# EAGLE design can_shield_simplified (EAGLE 7.7.0)
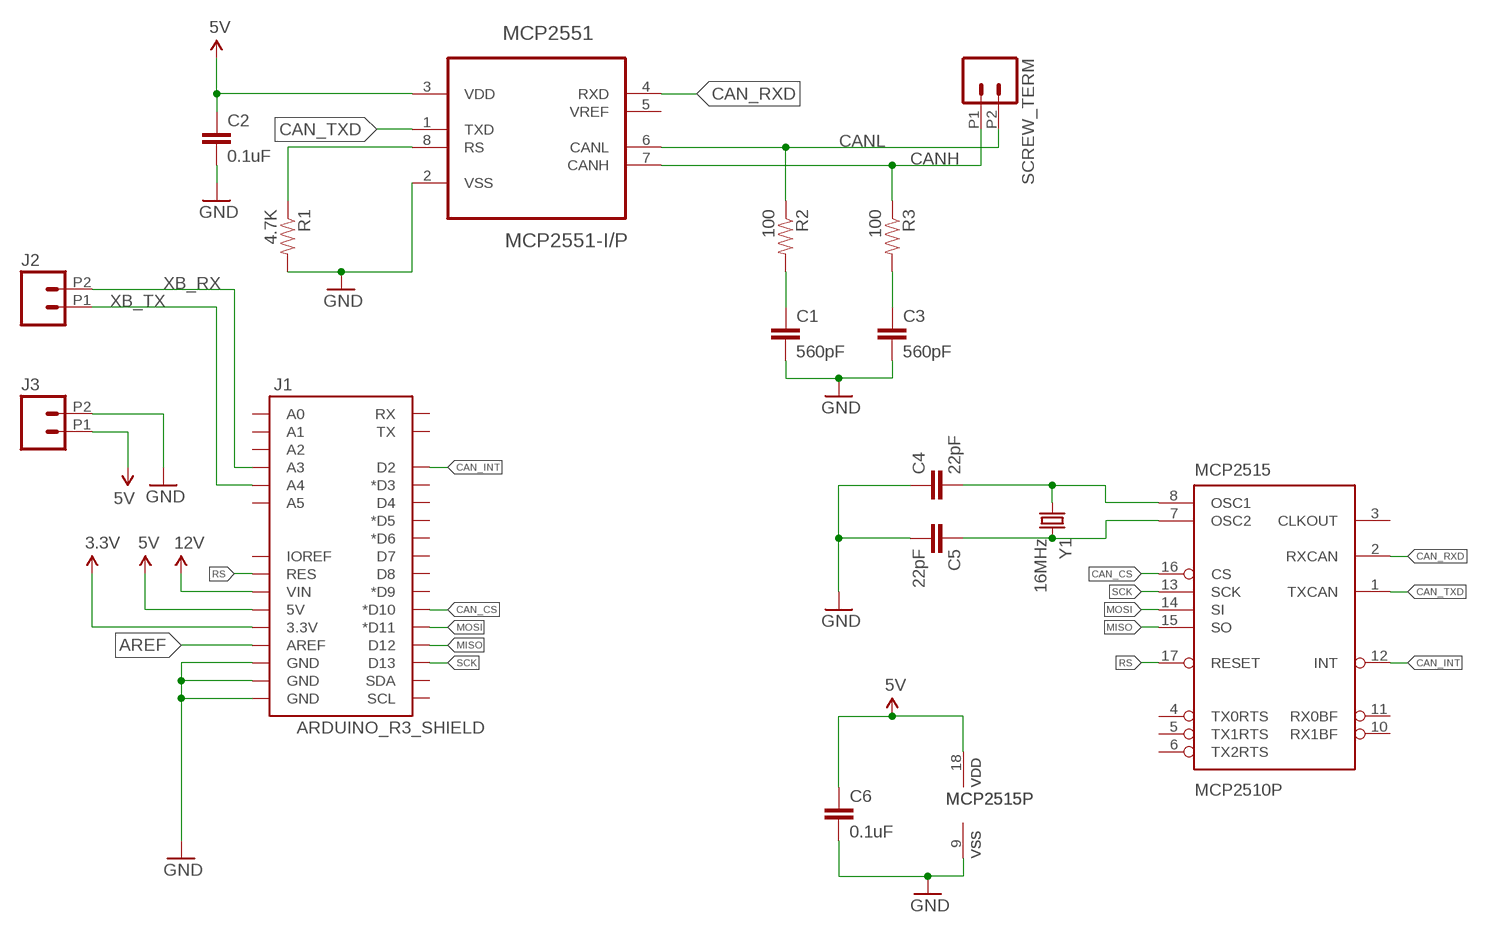
[diagram p0: schematic, sheet 1]

## Parts
C1  560pF  CAPPTH  [CAP-PTH-SMALL]
C2  0.1uF  CAPPTH  [CAP-PTH-SMALL]
C3  560pF  CAPPTH  [CAP-PTH-SMALL]
C4  22pF  CAPPTH  [CAP-PTH-SMALL]
C5  22pF  CAPPTH  [CAP-PTH-SMALL]
C6  0.1uF  CAPPTH  [CAP-PTH-SMALL]
J1  ARDUINO_R3_SHIELD  [UNO_R3_SHIELD]
J2  M022.54MM_SCREWTERM  [1X02_2.54_SCREWTERM]
J3  M022.54MM_SCREWTERM  [1X02_2.54_SCREWTERM]
MCP2515  MCP2510P  [DIL18]
MCP2551  MCP2551-I/P  [DIP254P762X432-8]
R1  4.7K  RESISTORAXIAL-0.3  [AXIAL-0.3]
R2  100  RESISTORAXIAL-0.3  [AXIAL-0.3]
R3  100  RESISTORAXIAL-0.3  [AXIAL-0.3]
SCREW_TERM  M022.54MM_SCREWTERM  [1X02_2.54_SCREWTERM]
Y1  16MHz  CRYSTALHC49US  [HC49US]

## Nets
3.3V: J1.3.3V
5V: C2.1 C6.1 J1.5V J3.P1 MCP2515.18(VDD) MCP2551.3(VDD)
12V: J1.VIN
AREF: J1.AREF
CAN_CS: J1.D10(*D10) MCP2515.16(CS)
CAN_INT: J1.D2 MCP2515.12(INT)
CAN_RXD: MCP2515.2(RXCAN) MCP2551.4(RXD)
CAN_TXD: MCP2515.1(TXCAN) MCP2551.1(TXD)
CANH: MCP2551.7(CANH) R3.P$1 SCREW_TERM.P1
CANH_CAP: C3.1 R3.P$2
CANL: MCP2551.6(CANL) R2.P$1 SCREW_TERM.P2
CANL_CAP: C1.1 R2.P$2
GND: C1.2 C2.2 C3.2 C4.1 C5.2 C6.2 J1.GND@0(GND) J1.GND@1(GND) J1.GND@2(GND) J3.P2 MCP2515.9(VSS) MCP2551.2(VSS) R1.P$2
MISO: J1.D12 MCP2515.15(SO)
MOSI: J1.D11(*D11) MCP2515.14(SI)
N$1: MCP2551.8(RS) R1.P$1
N$2: C4.2 MCP2515.8(OSC1) Y1.1
N$3: C5.1 MCP2515.7(OSC2) Y1.2
RS: J1.RES MCP2515.17(RESET)
SCK: J1.D13 MCP2515.13(SCK)
XB_RX: J1.A3 J2.P2
XB_TX: J1.A4 J2.P1
Unconnected: J1.A0 J1.A1 J1.A2 J1.A5 J1.D3(*D3) J1.D4 J1.D5(*D5) J1.D6(*D6) J1.D7 J1.D8 J1.D9(*D9) J1.IOREF J1.RX J1.SCL J1.SDA J1.TX MCP2515.3(CLKOUT) MCP2515.4(TX0RTS) MCP2515.5(TX1RTS) MCP2515.6(TX2RTS) MCP2515.10(RX1BF) MCP2515.11(RX0BF) MCP2551.5(VREF)

## Library data of the parts
C1-C6 = SparkFun-Passives:CAP: Capacitor Standard 0603 ceramic capacitor, and 0.1" leaded capacitor.
J1 = SparkFun-Boards:ARDUINO_R3_SHIELD: Shield form compatible with the Arduino Uno R3.
J2 J3 SCREW_TERM = SparkFun-Connectors:M02: Standard 2-pin 0.1" header. Use with - straight break away headers ( PRT-00116) - right angle break away headers (PRT-00553) - swiss pins (PRT-00743) - machine pins (PRT-00117) - female headers (PRT-00115) Molex polarized connector foot print use with: PRT-08233 with associated crimp pins and housings. 2.54_SCREWTERM for use with PRT-10571. 3.5mm Screw Terminal footprints for PRT-08084 5mm Screw Terminal footprints for use with PRT-08432
MCP2515 = SparkFun-DigitalIC:MCP2510: CAN controller with SPI interface to any MCU. Original design by Microchip.
MCP2551 = can_transceiver:MCP2551-I/P: High-Speed CAN Transceiver; DESCRIPTION: CAN CTRL; MPN: MCP2551-I/P; OC_FARNELL: 1292240; OC_NEWARK: 61K2947; PACKAGE: PDIP-8; SUPPLIER: Microchip
R1-R3 = SparkFun-Passives:RESISTOR: Resistor Basic schematic elements and footprints for 0603, 1206, and PTH resistors.
Y1 = SparkFun-FreqCtrl:CRYSTAL: Various standard crystals. Proven footprints.

## Board
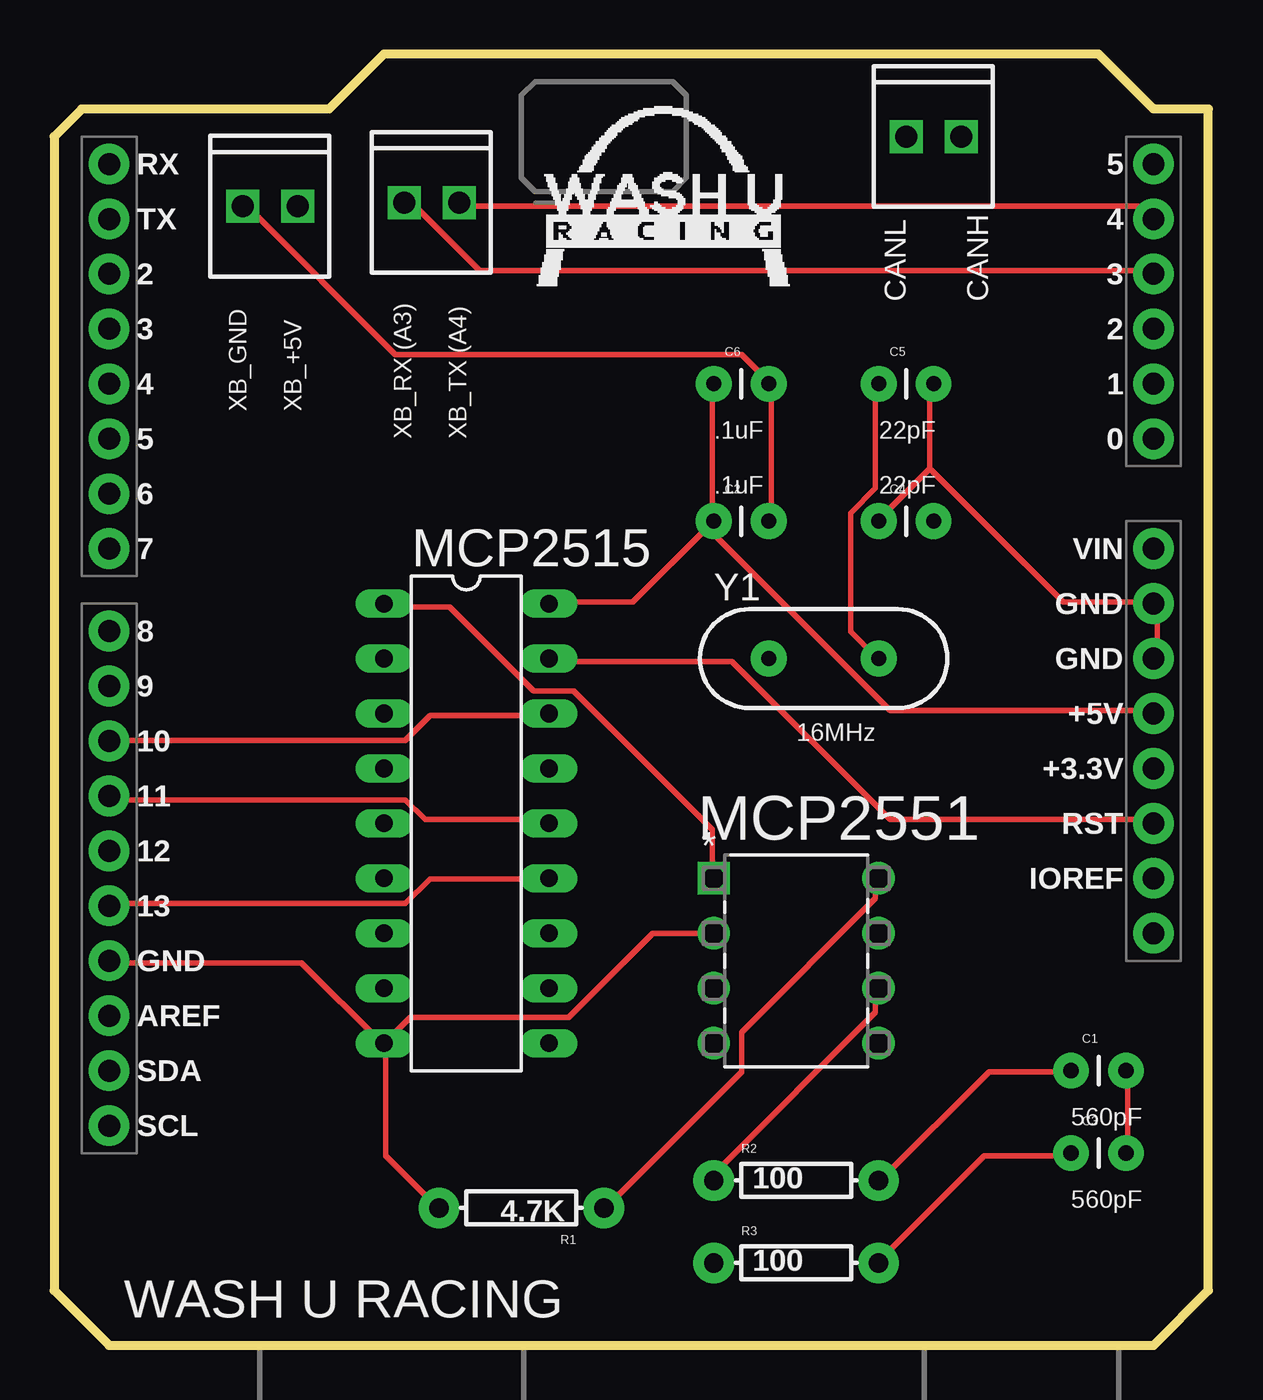
[diagram p1: board, top side]
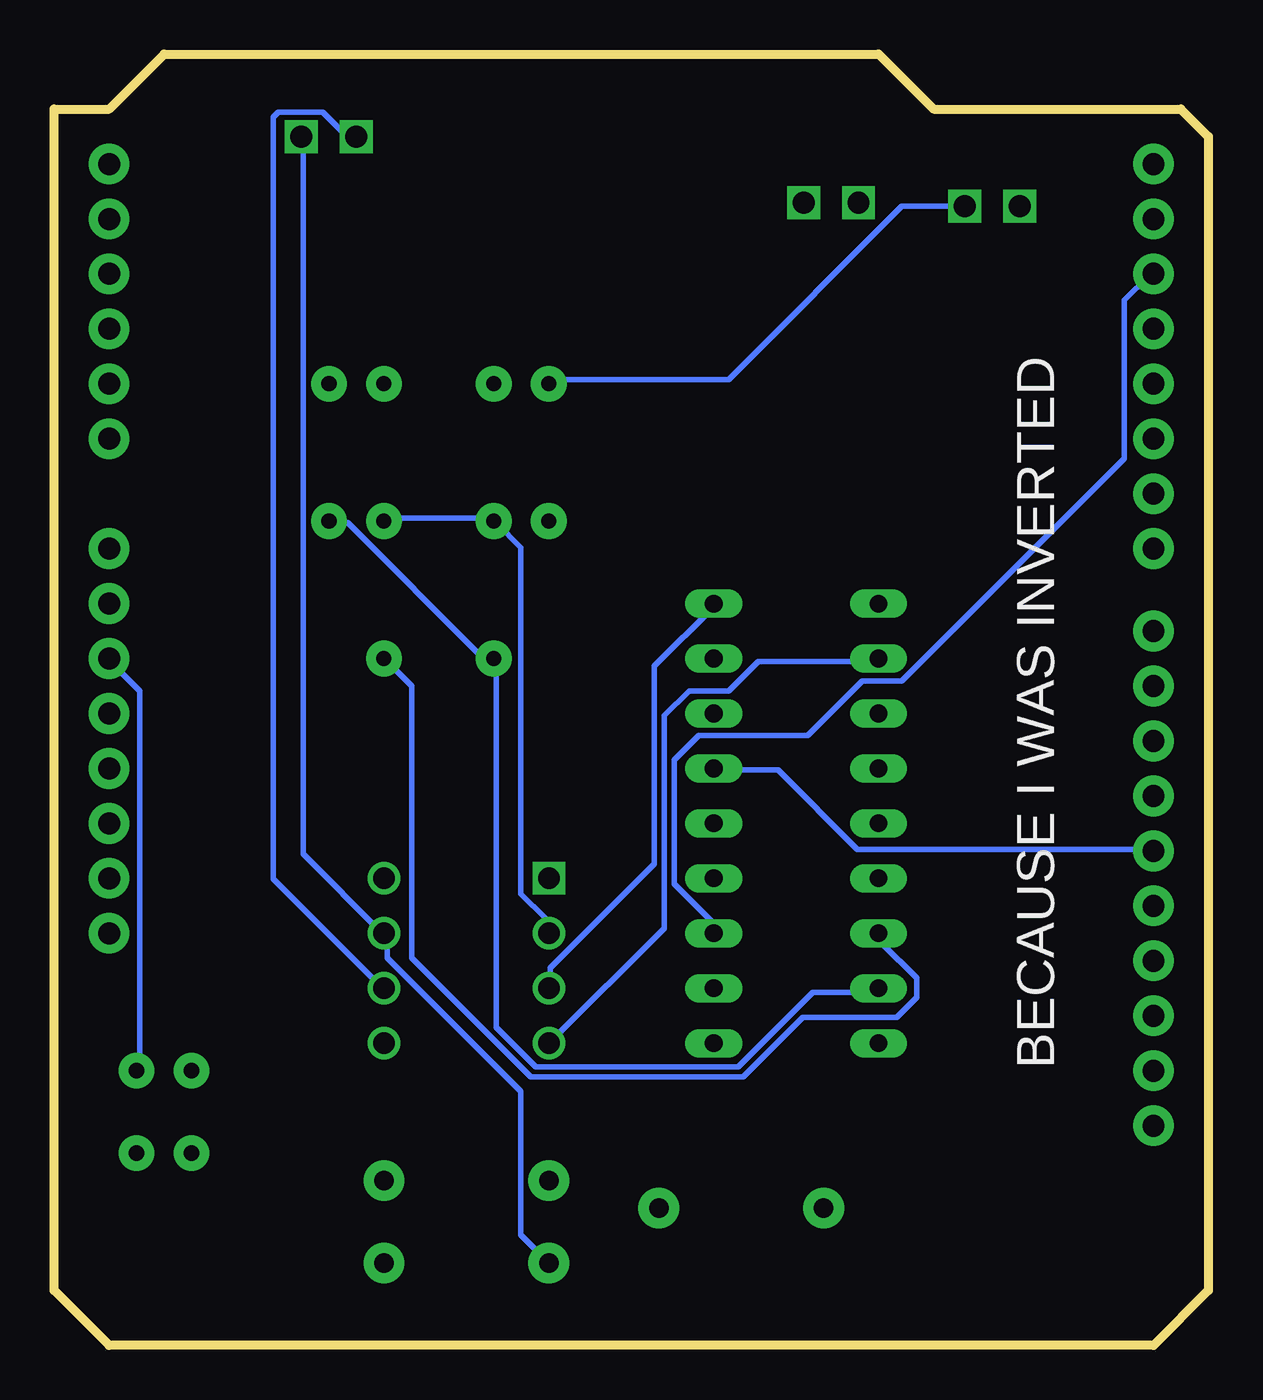
[diagram p2: board, bottom side, seen from below]

Size 53.34 x 59.69 mm. Coordinates in mm from the lower left corner, seen from the top.
Outline: 1.27,57.15 0,55.88 0,2.54 2.54,0 50.8,0 53.34,2.54 53.34,57.15 50.8,57.15 48.26,59.69 15.24,59.69 12.7,57.15 1.27,57.15
Copper layers (1*16): Top 0.035mm / dielectric 1.5mm / Bottom 0.035mm
Design rules "default": minimum track width 10mil, minimum drill 24mil, track to track 8mil, track to pad 8mil, pad to pad 8mil, via to via 8mil, smd to smd 8mil, copper to edge 40mil, drill to drill 8mil, minimum pad ring 10mil, minimum via ring 8mil, stop-mask expansion 4mil, vias tented up to drill 0mil, thermal gap 10mil

### Footprints (pad centres in the part's own frame; a part is rotated, then mirrored left to right if it is on the bottom)
CAP-PTH-SMALL = drill 0.7 pad 1.651: 1 0,0; 2 2.54,0
UNO_R3_SHIELD = drill 1.016 pad 1.88: 3.3V 50.8,26.67; 5V 50.8,29.21; A0 50.8,41.91; A1 50.8,44.45; A2 50.8,46.99; A3 50.8,49.53; A4 50.8,52.07; A5 50.8,54.61; AREF 2.54,15.24; D2 2.54,49.53; D3 2.54,46.99; D4 2.54,44.45; D5 2.54,41.91; D6 2.54,39.37; D7 2.54,36.83; D8 2.54,33.02; D9 2.54,30.48; D10 2.54,27.94; D11 2.54,25.4; D12 2.54,22.86; D13 2.54,20.32; GND@0 50.8,31.75; GND@1 50.8,34.29; GND@2 2.54,17.78; IOREF 50.8,21.59; NC 50.8,19.05; RES 50.8,24.13; RX 2.54,54.61; SCL 2.54,10.16; SDA 2.54,12.7; TX 2.54,52.07; VIN 50.8,36.83
1X02_2.54_SCREWTERM = drill 1.016 square: P1 2.54,0; P2 0,0
DIL18 = drill 0.813 long: 1 -10.16,-3.81; 2 -7.62,-3.81; 3 -5.08,-3.81; 4 -2.54,-3.81; 5 0,-3.81; 6 2.54,-3.81; 7 5.08,-3.81; 8 7.62,-3.81; 9 10.16,-3.81; 10 10.16,3.81; 11 7.62,3.81; 12 5.08,3.81; 13 2.54,3.81; 14 0,3.81; 15 -2.54,3.81; 16 -5.08,3.81; 17 -7.62,3.81; 18 -10.16,3.81
DIP254P762X432-8 = drill 0.991 square: 1 -7.62,7.62 | drill 0.991: 2 -7.62,5.08; 3 -7.62,2.54; 4 -7.62,0; 5 0,0; 6 0,2.54; 7 0,5.08; 8 0,7.62
AXIAL-0.3 = drill 0.9 pad 1.88: P$1 -3.81,0; P$2 3.81,0
HC49US = drill 0.7 pad 1.651: 1 -2.54,0; 2 2.54,0

### Placement (x,y rotation side)
C1  46.99,12.7 0 top
C2  30.48,38.1 0 top
C3  46.99,8.89 0 top
C4  38.1,38.1 0 top
C5  38.1,44.45 0 top
C6  30.48,44.45 0 top
J1  0,0 0 top
J2  16.17,52.83 0 top
J3  8.72,52.66 0 top
MCP2515  19.05,24.13 270 top
MCP2551  38.1,13.97 0 top
R1  21.59,6.35 180 top
R2  34.29,7.62 0 top
R3  34.29,3.81 0 top
SCREW_TERM  39.37,55.88 0 top
Y1  35.56,31.75 0 top

### Tracks (layer width: path | path; a pad name or v marks a point on that pad's centre or on a via)
5V
  Top 0.254: C2.1 30.18,37.79 | 30.18,37.79 26.75,34.37 22.86,34.37 MCP2515.18 | 30.18,37.79 38.63,29.34 50.75,29.34 J1.5V | 30.4,38.02 C2.1 | C6.1 30.4,44.42 30.4,38.25 C2.1
  Bottom 0.254: J3.P1 11.43,52.65 14.17,52.65 22.17,44.65 30.4,44.65 C6.1 | MCP2551.3 30.4,16.53 30.4,17.45 25.6,22.25 25.6,31.39 22.86,34.14 MCP2515.18
CAN_CS
  Top 0.254: MCP2515.16 22.86,29.11 17.37,29.11 16.23,27.96 2.74,27.96 J1.D10
CAN_INT
  Bottom 0.254: MCP2515.12 22.86,19.51 24.69,21.34 24.69,27.05 23.55,28.19 18.52,28.19 16,30.71 14.17,30.71 3.89,41 3.89,48.31 2.74,49.45 J1.D2
CAN_RXD
  Bottom 0.254: MCP2515.2 15.32,31.62 20.8,31.62 22.17,30.25 24,30.25 25.15,29.11 25.15,19.28 30.4,14.02 MCP2551.4
CAN_TXD
  Top 0.254: MCP2515.1 15.32,34.14 18.29,34.14 22.17,30.25 24,30.25 30.4,23.85 30.4,21.79 MCP2551.1
CANH
  Bottom 0.254: R3.P$1 31.77,5.1 31.77,11.74 37.95,17.91 37.95,19.05 MCP2551.7 38.18,19.05 41.83,22.71 41.83,55.85 SCREW_TERM.P1
CANH_CAP
  Top 0.254: C3.1 46.86,8.76 42.98,8.76 38.18,3.96 R3.P$2
CANL
  Top 0.254: MCP2551.6 37.95,16.31 37.95,15.39 30.63,8.08 30.63,7.62 R2.P$1
  Bottom 0.254: SCREW_TERM.P2 39.55,56.08 40.01,56.08 40.92,57 42.98,57 43.2,56.77 43.2,21.56 38.18,16.53 MCP2551.6
CANL_CAP
  Top 0.254: C1.1 46.86,12.65 43.2,12.65 38.18,7.62 R2.P$2
GND
  Top 0.254: MCP2515.9 15.32,13.79 15.32,8.76 17.6,6.48 R1.P$2 | MCP2551.2 27.66,19.05 23.77,15.16 16.46,15.16 15.32,14.02 MCP2515.9 | J1.GND@2 2.74,17.68 11.43,17.68 15.09,14.02 MCP2515.9 | C3.2 49.61,8.99 49.61,12.65 C1.2 | J1.GND@0 50.98,31.85 50.98,34.14 J1.GND@1 50.75,34.37 46.63,34.37 40.46,40.54 | 40.46,40.54 40.46,44.42 C5.2 | 40.46,40.54 38.18,38.25 C4.1 | J3.P2 8.91,52.65 15.77,45.8 31.77,45.8 32.92,44.65 C6.2 33.15,44.42 33.15,38.25 C2.2
  Bottom 0.254: C1.2 49.38,12.88 49.38,30.25 50.75,31.62 J1.GND@0 | C4.1 37.95,38.25 33.15,38.25 C2.2 32.92,38.02 31.77,36.88 31.77,20.88 30.63,19.74 30.63,19.05 MCP2551.2
MISO
  Bottom 0.254: MCP2515.15 22.86,26.59 19.89,26.59 16.23,22.94 2.74,22.94 J1.D12
MOSI
  Top 0.254: MCP2515.14 22.86,24.31 17.14,24.31 16.23,25.22 2.74,25.22 J1.D11
N$1
  Top 0.254: MCP2551.8 37.95,21.56 37.95,20.65 31.77,14.48 31.77,12.65 25.6,6.48 R1.P$1
N$2
  Bottom 0.254: MCP2515.8 15.32,16.31 18.29,16.31 21.72,12.88 31.09,12.88 32.92,14.71 32.92,31.62 Y1.1 33.15,31.85 33.6,31.85 39.78,38.02 40.46,38.02 C4.2
N$3
  Top 0.254: C5.1 37.95,44.42 37.95,39.62 36.8,38.48 36.8,32.99 37.95,31.85 Y1.2
  Bottom 0.254: MCP2515.7 15.09,19.05 15.09,18.59 13.49,16.99 13.49,16.08 14.4,15.16 18.75,15.16 21.49,12.42 31.32,12.42 36.8,17.91 36.8,30.48 37.95,31.62 Y1.2
RS
  Top 0.254: MCP2515.17 22.86,31.62 31.32,31.62 38.63,24.31 50.75,24.31 J1.RES
SCK
  Top 0.254: MCP2515.13 22.86,21.56 17.37,21.56 16.23,20.42 2.74,20.42 J1.D13
XB_RX
  Top 0.254: J2.P2 16.23,52.65 16.69,52.65 19.66,49.68 50.75,49.68 J1.A3
XB_TX
  Top 0.254: J2.P1 18.75,52.65 50.29,52.65 50.75,52.2 J1.A4

### Text on the board
tPlace: CANL | CANH | XB_GND | XB_+5V | XB_RX (A3) | XB_TX (A4) | .1uF | 22pF | .1uF | 22pF | 16MHz | 560pF | 560pF | WASH U RACING
bPlace: BECAUSE I WAS INVERTED